# Altium schematic sheet P_iron_V3.0_2020-11-07_00-05-42.schdoc
size 303 x 196 mm
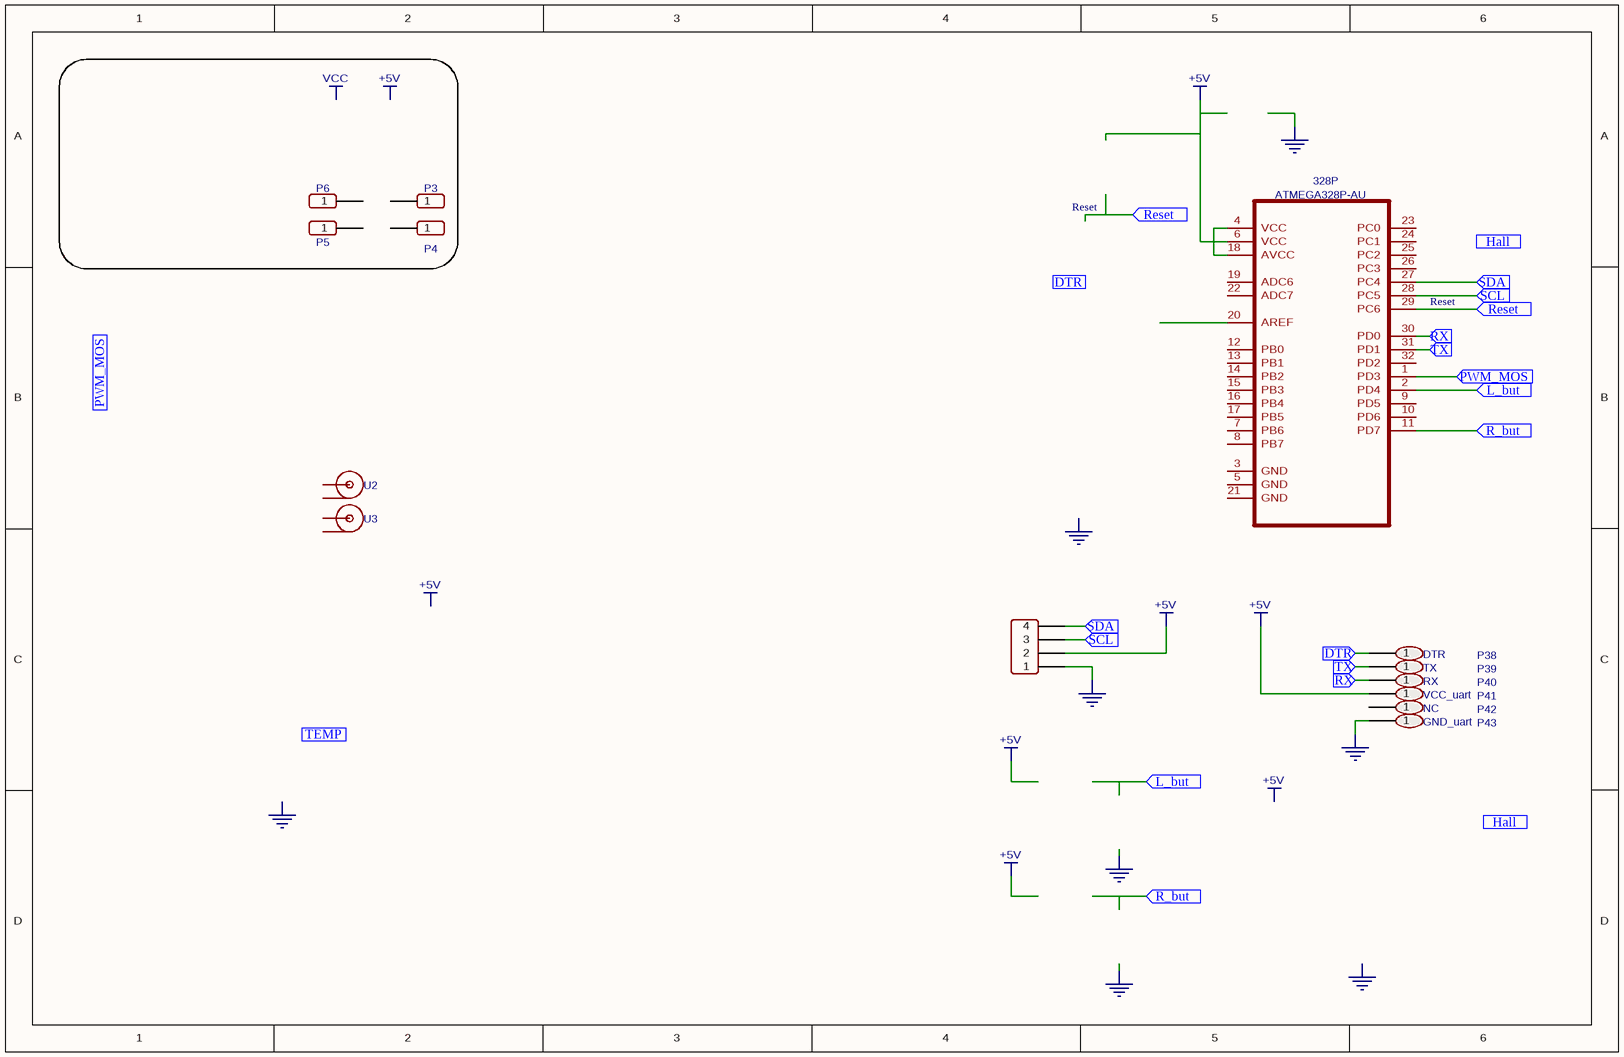
[diagram p0: P_iron_V3.0_2020-11-07_00-05-42.schdoc]

## Parts
328P  ATMEGA328P-AU  [TQFP32]
P1  i2c_OLED  [HDR-4X1/2.54]  (value not drawn)
P3  Header 1*1P  [HDR-1X1/2.54]  (value not drawn)
P4  Header 1*1P  [HDR-1X1/2.54]  (value not drawn)
P5  Header 1*1P  [HDR-1X1/2.54]  (value not drawn)
P6  Header 1*1P  [HDR-1X1/2.54]  (value not drawn)
P38  DTR  [HDR-1X1/2.54]
P39  TX  [HDR-1X1/2.54]
P40  RX  [HDR-1X1/2.54]
P41  VCC_uart  [HDR-1X1/2.54]
P42  NC  [HDR-1X1/2.54]
P43  GND_uart  [HDR-1X1/2.54]
U2  Fuse clip 1p TH  [FUSE CLIP 2P PCB]  (value not drawn)
U3  Fuse clip 1p TH  [FUSE CLIP 2P PCB]  (value not drawn)

## Ports
DTR (in), Hall (in), L_but (in), PWM_MOS (in), R_but (in), Reset (in), RX (in), SCL (in), SDA (in), TEMP (in), TX (in)

## Nets
+5V: 328P.4(VCC) 328P.6(VCC) 328P.18(AVCC) P1.2 P41.1
GND: P1.1 P43.1
DTR: P38.1 ; port DTR
L_but: 328P.2(PD4) ; port L_but
PWM_MOS: 328P.1(PD3) ; port PWM_MOS
R_but: 328P.11(PD7) ; port R_but
Reset: 328P.29(PC6) ; port Reset
RX: 328P.30(PD0) P40.1 ; port RX
SCL: 328P.28(PC5) P1.3 ; port SCL
SDA: 328P.27(PC4) P1.4 ; port SDA
TX: 328P.31(PD1) P39.1 ; port TX

Not connected (* = marked no-connect by the designer): 328P 3(GND) 5(GND) 7(PB6) 8(PB7) 9(PD5) 10(PD6) 12(PB0) 13(PB1) 14(PB2) 15(PB3) 16(PB4) 17(PB5) 19(ADC6) 20(AREF) 21(GND) 22(ADC7) 23(PC0) 24(PC1) 25(PC2) 26(PC3) 32(PD2); P3 1; P4 1; P5 1; P6 1; P42 1; U2 1; U3 1

## Notes on the sheet
- Labels drawn without touching a wire or pin: +5V, GND, Reset, VCC

## Library data of the parts
328P = ATMEGA328P-AU: catid: 20; BOM_Manufacturer Part: ?; spicePre: U
P1 = i2c_OLED: BOM_Manufacturer: ReliaPro; BOM_Manufacturer Part: Headers  Pins 1*4P; BOM_Supplier: LCSC; image: http://image.lceda.cn/szlcsc/C59481.jpg; spicePre: P; BOM_Supplier Part: undefined
P3-P6 = Header 1*1P: BOM_Manufacturer: ReliaPro; BOM_Supplier: LCSC; BOM_Manufacturer Part: Header 1*1P; spicePre: P; BOM_Supplier Part: C81276
P38 = DTR: BOM_Manufacturer: ReliaPro; BOM_Manufacturer Part: Header 1*1P; BOM_Supplier: LCSC; spicePre: P; BOM_Supplier Part: C81276
P39 = TX: BOM_Manufacturer: ReliaPro; BOM_Manufacturer Part: Header 1*1P; BOM_Supplier: LCSC; spicePre: P; BOM_Supplier Part: C81276
P40 = RX: BOM_Manufacturer: ReliaPro; BOM_Manufacturer Part: Header 1*1P; BOM_Supplier: LCSC; spicePre: P; BOM_Supplier Part: C81276
P41 = VCC_uart: BOM_Manufacturer: ReliaPro; BOM_Manufacturer Part: Header 1*1P; BOM_Supplier: LCSC; spicePre: P; BOM_Supplier Part: C81276
P42 = NC: BOM_Manufacturer: ReliaPro; BOM_Manufacturer Part: Header 1*1P; BOM_Supplier: LCSC; spicePre: P; BOM_Supplier Part: C81276
P43 = GND_uart: BOM_Manufacturer: ReliaPro; BOM_Manufacturer Part: Header 1*1P; BOM_Supplier: LCSC; spicePre: P; BOM_Supplier Part: C81276
U2 U3 = Fuse clip 1p TH: BOM_Manufacturer: XCFuse; BOM_Manufacturer Part: 5x20 RHOS Fuse clip/seat; Contributor: gjt211; BOM_Supplier: LCSC; image: //image.lceda.cn/szlcsc/C3130.jpg; spicePre: U; BOM_Supplier Part: C3130